# EAGLE design IMU_connection_board (EAGLE 8.4.1)
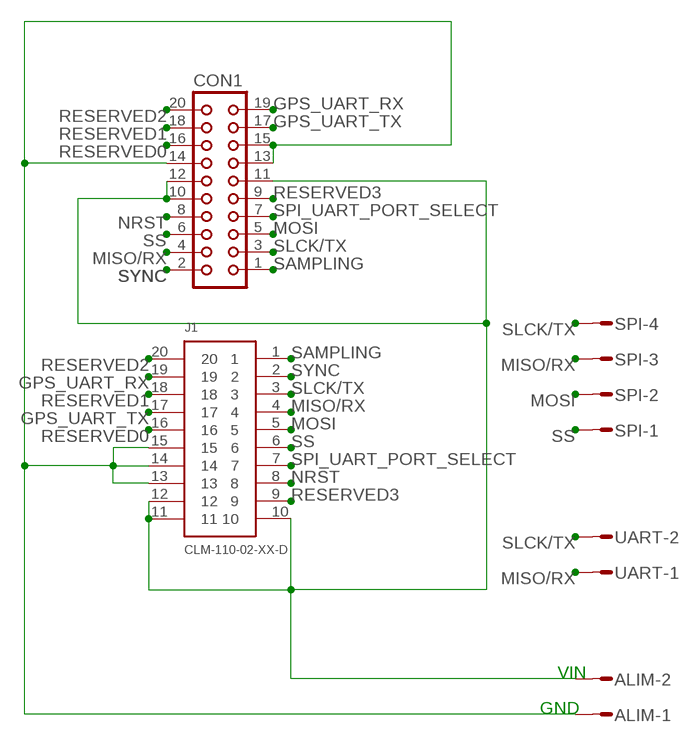
[diagram p0: schematic, sheet 1]

## Parts
ALIM  L02P  [L02P]
CON1  CON20  [CON20]
J1  CLM-110-02-XX-D  [CLM-110-02-XX-D]
SPI  L04P  [L04P]
UART  L02P  [L02P]

## Nets
GND: ALIM.1 CON1.13 CON1.14 CON1.15 J1.13 J1.14 J1.15
GPS_UART_RX: CON1.19 J1.19
GPS_UART_TX: CON1.17 J1.17
MISO/RX: CON1.4 J1.4 SPI.3 UART.1
MOSI: CON1.5 J1.5 SPI.2
NRST: CON1.8 J1.8
RESERVED0: CON1.16 J1.16
RESERVED1: CON1.18 J1.18
RESERVED2: CON1.20 J1.20
RESERVED3: CON1.9 J1.9
SAMPLING: CON1.1 J1.1
SLCK/TX: CON1.3 J1.3 SPI.4 UART.2
SPI_UART_PORT_SELECT: CON1.7 J1.7
SS: CON1.6 J1.6 SPI.1
SYNC: CON1.2 J1.2
VIN: ALIM.2 CON1.10 CON1.11 CON1.12 J1.10 J1.11 J1.12

## Notes on the sheet
- VIN
- GND

## Library data of the parts
ALIM UART = con-amp-mt:L02P: AMP MT CONNECTOR; OC_FARNELL: unknown; OC_NEWARK: unknown
CON1 = con-harting:CON20: CONNECTOR; OC_FARNELL: unknown; OC_NEWARK: unknown
J1 = CLM-110-02-XX-D:CLM-110-02-XX-D: LOW PROFILE 1MMX1MM DOUBLE ROW BODY. MANUFACTURER:SAMTEC. // Modified by FCAM1 Date : 20_12_17 Modification : Mirror effect //
SPI = con-amp-mt:L04P: AMP MT CONNECTOR; OC_FARNELL: unknown; OC_NEWARK: unknown

## Board
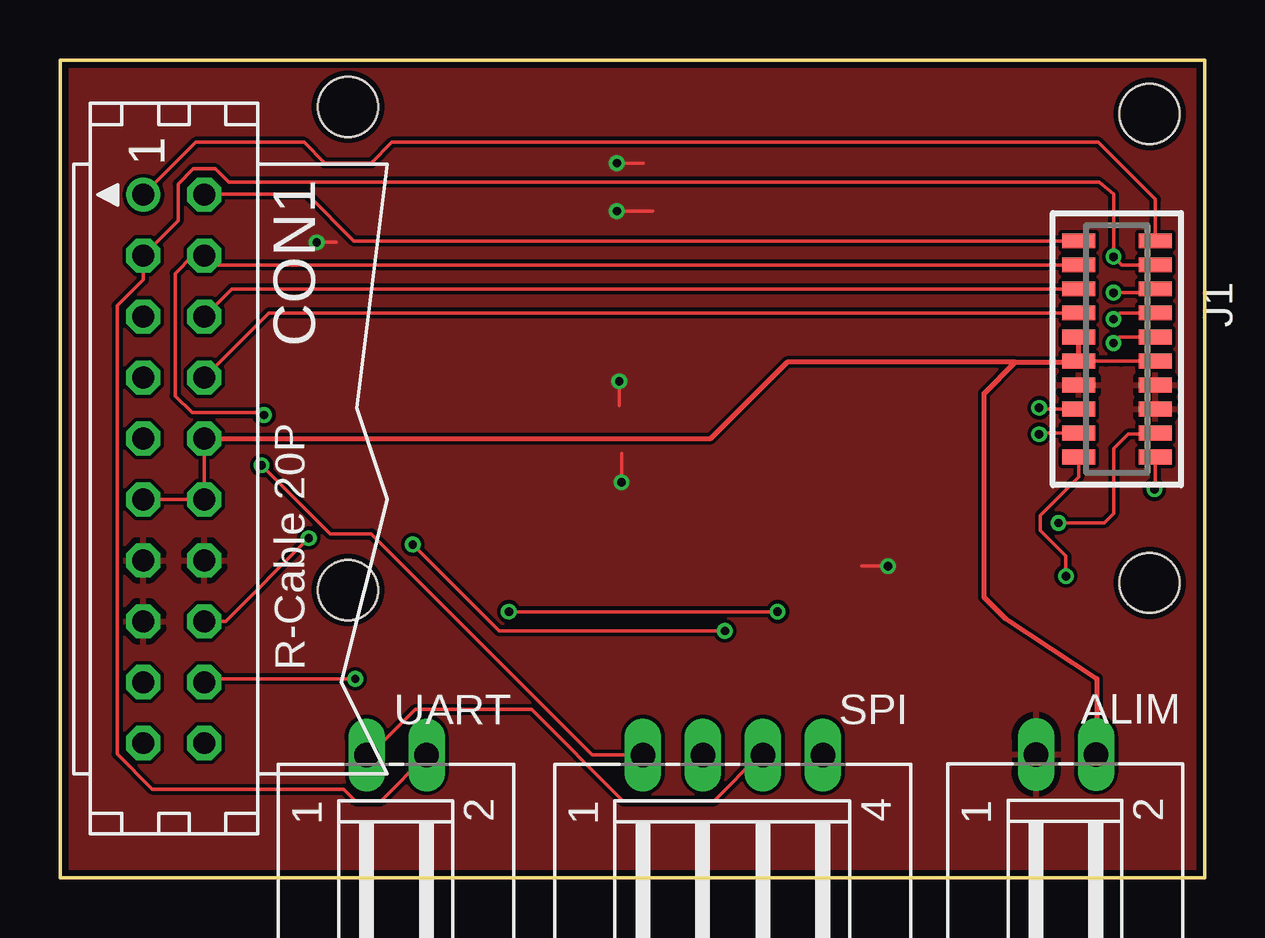
[diagram p1: board, top side]
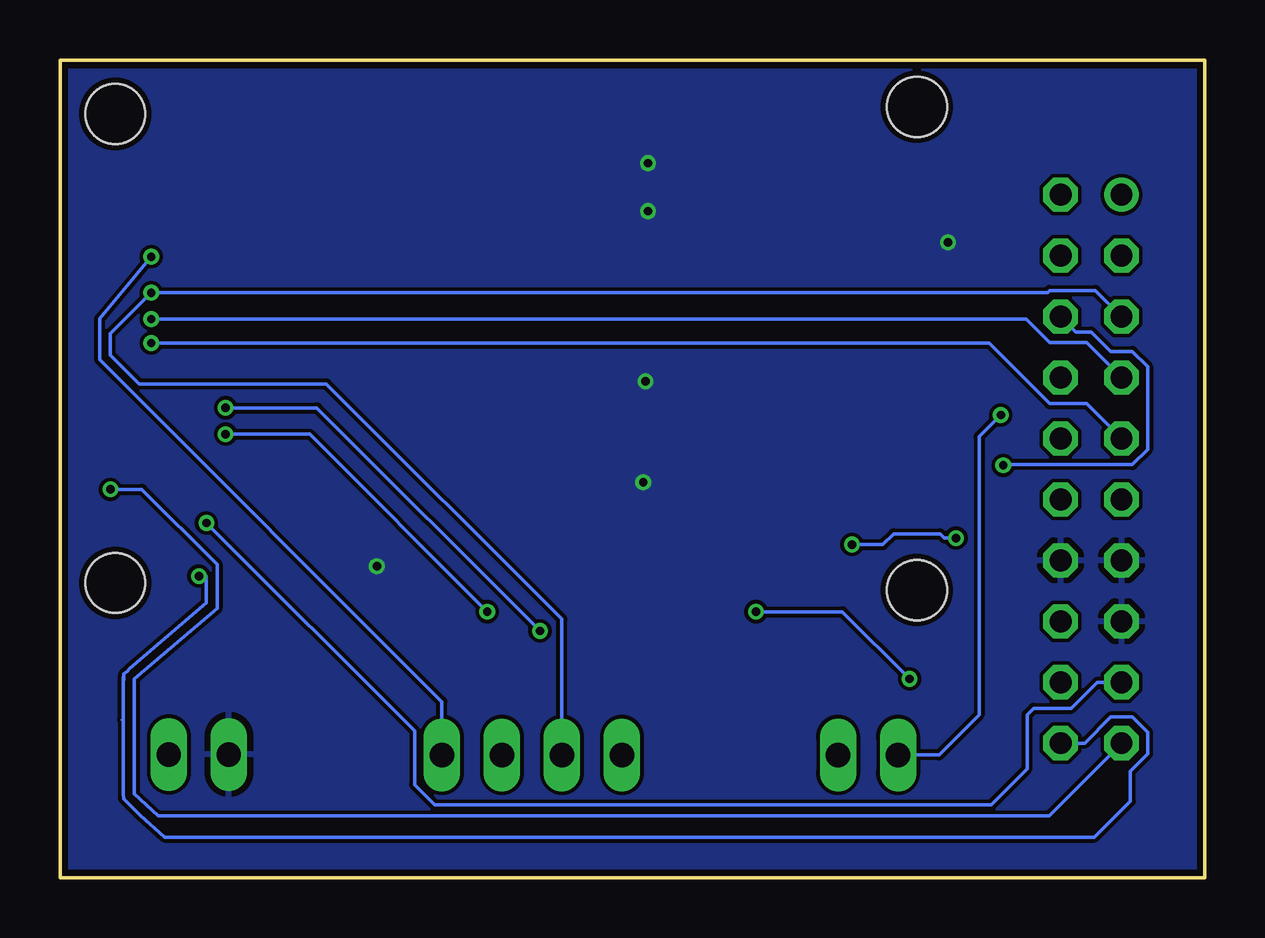
[diagram p2: board, bottom side, seen from below]

Size 47.7 x 34.1 mm. Coordinates in mm from the lower left corner, seen from the top.
Outline: 0,0 47.7,0 47.7,34.1 0,34.1 0,0
Copper layers (1*16): Top 0.035mm / dielectric 1.5mm / Bottom 0.035mm
Design rules "SeeedStudio_2layer_DRU_no_angle_20140221": minimum track width 6mil, minimum drill 12mil, track to track 6mil, track to pad 6mil, pad to pad 6mil, via to via 6mil, smd to smd 0mil, copper to edge 10mil, drill to drill 10mil, minimum pad ring 10mil, minimum via ring 6mil, stop-mask expansion 2mil, vias tented up to drill 100mil, thermal gap 10mil
Holes 2.5 mm at 12,32.15 12,12 45.4,31.85 45.4,12.3

### Footprints (pad centres in the part's own frame; a part is rotated, then mirrored left to right if it is on the bottom)
L02P = drill 1.016 long: 1 1.25,-6.25; 2 -1.25,-6.25
CON20 = drill 0.914: 1 -11.43,-1.27 | drill 0.914 octagon: 2 -11.43,1.27; 3 -8.89,-1.27; 4 -8.89,1.27; 5 -6.35,-1.27; 6 -6.35,1.27; 7 -3.81,-1.27; 8 -3.81,1.27; 9 -1.27,-1.27; 10 -1.27,1.27; 11 1.27,-1.27; 12 1.27,1.27; 13 3.81,-1.27; 14 3.81,1.27; 15 6.35,-1.27; 16 6.35,1.27; 17 8.89,-1.27; 18 8.89,1.27; 19 11.43,-1.27; 20 11.43,1.27
CLM-110-02-XX-D = smd 0.61 x 1.372: 1 4.503,-1.6; 2 4.503,1.6; 3 3.503,-1.6; 4 3.503,1.6; 5 2.502,-1.6; 6 2.502,1.6; 7 1.501,-1.6; 8 1.501,1.6; 9 0.5,-1.6; 10 0.5,1.6; 11 -0.5,-1.6; 12 -0.5,1.6; 13 -1.501,-1.6; 14 -1.501,1.6; 15 -2.502,-1.6; 16 -2.502,1.6; 17 -3.503,-1.6; 18 -3.503,1.6; 19 -4.503,-1.6; 20 -4.503,1.6
L04P = drill 1.016 long: 1 3.75,-6.25; 2 1.25,-6.25; 3 -1.25,-6.25; 4 -3.75,-6.25

### Placement (x,y rotation side)
ALIM  41.92,-1.1 180 top
CON1  4.74,17.05 270 top
J1  44.04,22.05 90 top
SPI  28.04,-1.12 180 top
UART  14.03,-1.12 180 top

### Tracks (layer width: path | path; a pad name or v marks a point on that pad's centre or on a via)
GND  (via drill 0.35)
  Top 0.152: v23.4,16.5 23.4,17.7 | v23.3,20.7 23.3,19.7 | v23.2,27.8 24.7,27.8 | v23.2,29.8 24.3,29.8 | v10.7,26.5 11.5,26.5 | v34.5,13 33.4,13
  pour Top: 0.4,33.7 47.3,33.7 47.3,0.3 0.4,0.3
  pour Bottom: 0.3,33.8 0.3,0.3 47.3,0.3 47.3,33.8
GPS_UART_RX  (via drill 0.35)
  Top 0.152: J1.19 45.64,16.14 v45.6,16.2
  Bottom 0.152: 3.52,5.62 CON1.19 6.49,2.6 43.6,2.6 44.6,3.5 44.6,8.29 41.16,11.23 41.16,13.07 44.29,16.2 v45.6,16.2
GPS_UART_TX  (via drill 0.35)
  Top 0.152: J1.17 45.59,18.5 44.5,18.5 43.9,17.9 43.9,15.2 43.5,14.8 v41.6,14.8
  Bottom 0.152: v41.6,14.8 32.93,6.13 32.93,3.89 32.09,3.05 8.9,3.05 7.4,4.55 7.4,6.8 7.13,7.07 5.56,7.07 4.47,8.16 CON1.17
MISO/RX  (via drill 0.35)
  Top 0.152: J1.4 6.4,25.55 CON1.4 5.54,25.94 4.8,25.2 4.8,20.1 5.5,19.4 5.55,19.4 5.56,19.41 8.39,19.41 v8.5,19.3 | UART.1 12.91,5.12 14.81,7.03 19.65,7.03 23.45,3.23 27.26,3.23 29.16,5.12 SPI.3
  Bottom 0.152: v8.5,19.3 9.4,18.4 9.4,6.8 11.07,5.12 UART.1
MOSI  (via drill 0.35)
  Top 0.152: J1.5 45.49,24.4 v43.9,24.4
  Bottom 0.152: CON1.5 4.56,24.49 6.46,24.49 6.55,24.4 v43.9,24.4 45.6,22.7 45.6,21.8 44.4,20.6 36.6,20.6 26.79,10.79 SPI.2
NRST
  Top 0.152: J1.8 8.7,23.55 CON1.8
RESERVED0  (via drill 0.35)
  Top 0.152: J1.16 40.85,19.55 v40.8,19.6 | v27.7,10.3 18.3,10.3 v14.7,13.9 | v10.37,14.17 6.9,10.7 CON1.16
  Bottom 0.152: v40.8,19.6 37,19.6 v27.7,10.3 | v14.7,13.9 13.41,13.9 12.97,14.34 11.03,14.34 10.85,14.17 v10.37,14.17
RESERVED1  (via drill 0.35)
  Top 0.152: J1.18 40.85,18.55 v40.8,18.5 | v29.9,11.1 v18.7,11.1 | v12.3,8.3 6.15,8.3 CON1.18
  Bottom 0.152: v40.8,18.5 37.3,18.5 v29.9,11.1 | v18.7,11.1 15.1,11.1 v12.3,8.3
RESERVED2  (via drill 0.35)
  Top 0.152: J1.20 42.44,16.71 40.85,15.11 40.85,14.49 41.91,13.42 v41.91,12.58
  Bottom 0.152: 45.05,8.47 45.04,8.49 45.04,8.51 44.91,8.62 44.79,8.74 41.61,11.46 41.61,12.5 | 45.05,8.47 45.05,8.3 45.07,8.14 | 45.1,6.6 45.07,6.63 45.07,8.14 | 41.61,12.5 41.61,12.58 | 45.07,8.14 45.06,8.13 45.06,3.49 45.05,3.31 45.04,3.3 45.04,3.29 44.91,3.17 44.35,2.61 43.34,1.7 4.6,1.7 3.1,3.2 3.1,4.45 2.38,5.17 2.38,6.07 3.02,6.71 3.92,6.71 5.01,5.62 CON1.20 | 45.07,8.14 45.07,8.31 45.05,8.47 | v41.91,12.58 41.91,12.5 41.61,12.5
RESERVED3  (via drill 0.35)
  Top 0.152: J1.9 44.22,22.55 44.21,22.55 44.15,22.55 v43.9,22.3
  Bottom 0.152: CON1.9 4.92,19.77 6.46,19.77 8.99,22.3 v43.9,22.3
SAMPLING
  Top 0.152: J1.1 45.64,28.3 43.27,30.67 13.83,30.67 12.97,29.81 11.03,29.81 10.17,30.67 5.66,30.67 CON1.1
SLCK/TX  (via drill 0.35)
  Top 0.152: J1.3 44.25,25.55 v43.9,25.9 43.9,28.5 43.3,29 7.03,29 6.46,29.57 5.56,29.57 4.92,28.93 4.92,27.39 CON1.3 3.47,24.94 2.38,23.85 2.38,5.17 3.85,3.7 11.83,3.7 12.31,3.23 13.38,3.23 UART.2
  Bottom 0.152: v43.9,25.9 44.5,25.17 46.05,23.31 46.05,21.61 31.79,7.35 SPI.4
SPI_UART_PORT_SELECT  (via drill 0.35)
  Top 0.152: J1.7 44.15,23.55 v43.9,23.3
  Bottom 0.152: v43.9,23.3 7.45,23.3 6.46,22.31 4.92,22.31 CON1.7
SS  (via drill 0.35)
  Top 0.152: J1.6 7.16,24.55 CON1.6 | v8.4,17.2 11.26,14.34 12.97,14.34 22.19,5.12 SPI.1
  Bottom 0.152: CON1.6 5.38,22.77 4.74,22.77 3.92,21.95 3.02,21.95 2.38,21.31 2.38,17.87 3.02,17.23 8.37,17.23 v8.4,17.2
SYNC
  Top 0.152: J1.2 12.25,26.55 10.3,28.5 6.03,28.5 CON1.2
VIN
  Top 0.152: J1.11 44.22,21.55 44.21,21.55 43.59,21.55 43.58,21.55 J1.12 42.39,21.5 | 43.2,5.18 ALIM.2 | CON1.11 CON1.12 CON1.10
  Top 0.2: J1.12 J1.10 | 43.2,5.18 43.2,8.3 39.4,10.8 38.5,11.7 38.5,20.2 39.8,21.5 | CON1.10 27.12,18.32 30.3,21.5 39.8,21.5 | 39.8,21.5 42.39,21.5

### Text on the board
tTest: LAAS | CNRS | 1 | 2 | 3 | 4 | 20 | SS | MOSI | MISO | SLCK | RX | TX | GND | VIN